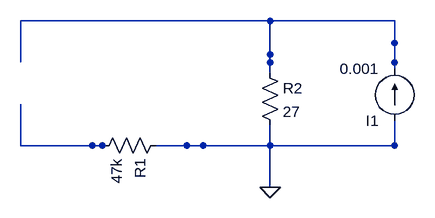
[diagram p0: schematic pannel2.asc]
pannel2.asc, the LTspice schematic file:
Version 4
SHEET 1 880 680
WIRE 464 384 537 384
WIRE 366 384 382 384
SYMBOL res 480 368 R90
SYMATTR InstName R1
SYMATTR Value 47k
WIRE 640 272 640 244
WIRE 640 384 640 352
SYMBOL res 624 256 R0
SYMATTR InstName R2
SYMATTR Value 27
WIRE 832 346 832 386
WIRE 832 226 832 266
SYMBOL current 832 346 R180
SYMATTR InstName I1
SYMATTR Value 0.001
FLAG 640 448 0
WIRE 640 384 704 384
WIRE 640 384 640 448
WIRE 576 384 640 384
WIRE 768 384 832 384
WIRE 832 192 832 256
WIRE 768 192 832 192
WIRE 640 192 704 192
WIRE 640 192 640 256
WIRE 576 192 640 192
WIRE 256 384 320 384
WIRE 256 320 256 384
WIRE 256 192 320 192
WIRE 256 192 256 256
WIRE 512 384 576 384
WIRE 320 384 384 384
WIRE 320 192 384 192
WIRE 384 192 448 192
WIRE 448 192 512 192
WIRE 512 192 576 192
WIRE 704 192 768 192
WIRE 704 384 768 384

The netlist it stands for:
* pannel2.asc
R1 0 N001 47k
R2 N002 0 27
I1 0 N002 0.001
.backanno
.end